# EAGLE schematic V3.6 - placa embutida (EAGLE 9.6.2)
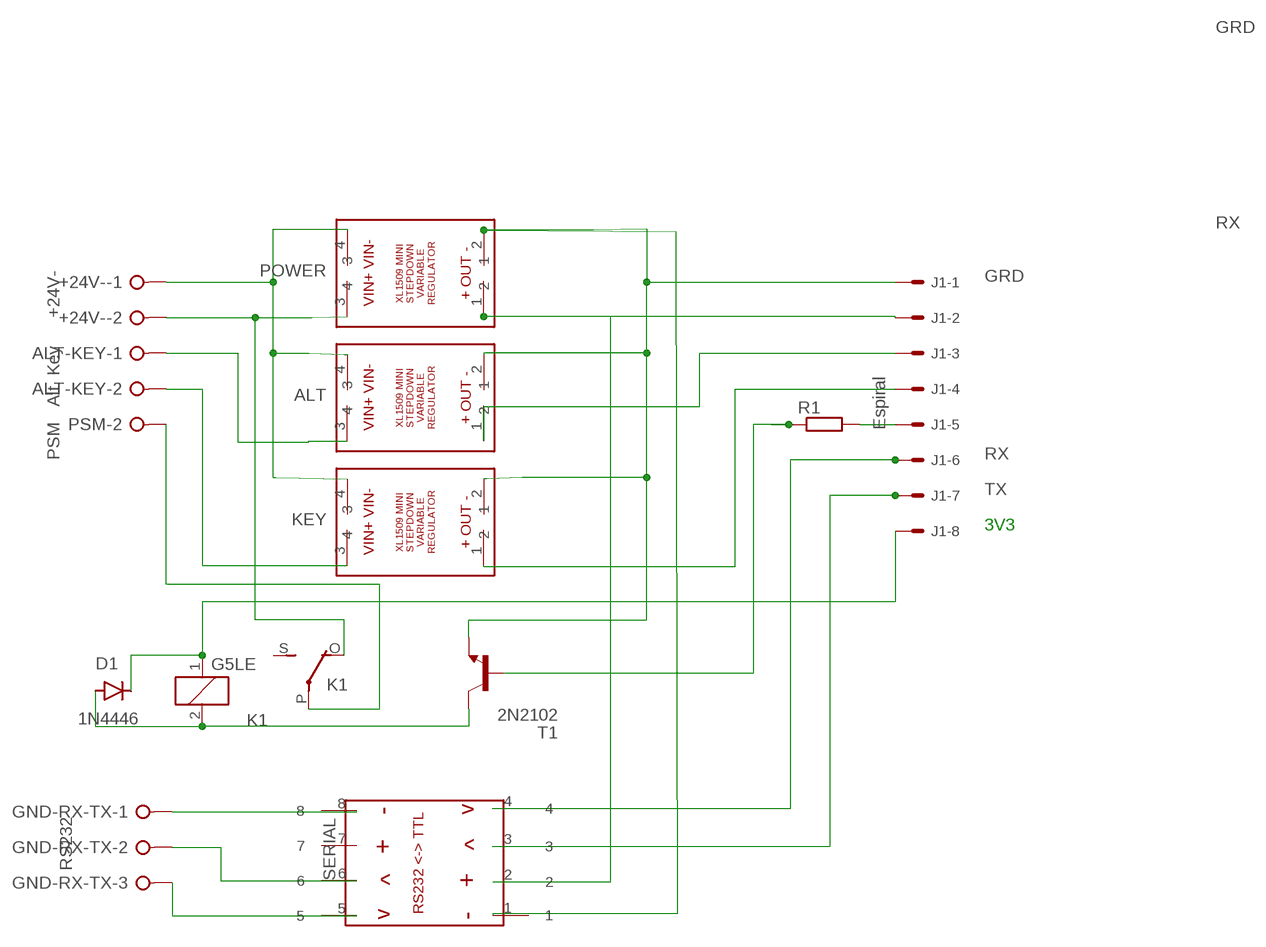
[diagram p0: schematic, sheet 1]

## Parts
+24V-  +24V-  W237-02P  [W237-132]
ALT  XL1509WITH_SMDPADS&THROUGHHOLES  [XL1509]
ALT-KEY  Alt Key  W237-02P  [W237-132]
D1  1N4446  [DO35-10]
GND-RX-TX  RS232  W237-03P  [W237-133]
J1  Espiral  22-05-7088-08  [7395-08]
K1  G5LE  [G5LE]
KEY  XL1509WITH_SMDPADS&THROUGHHOLES  [XL1509]
POWER  XL1509WITH_SMDPADS&THROUGHHOLES  [XL1509]
PSM  PSM  W237-02P  [W237-132]
R1  R-EU_0207/10  [0207/10]
SERIAL  MAX3232WITH_SMDPADS&THROUGHHOLES  [MAX3232]
T1  2N2102  [TO5]

## Nets
CHAVE: ALT.1 J1.3
GRD [New Class]: ALT.2 J1.1 KEY.2 POWER.2 SERIAL.1 T1.1(E)
N$1: +24V-.1 ALT.4 KEY.4 POWER.4
N$2: +24V-.2 K1.O(2:O) POWER.3
N$3: D1.C J1.8 K1.1
N$4: GND-RX-TX.1 SERIAL.8
N$5: ALT-KEY.1 ALT.3
N$6: ALT-KEY.2 KEY.3
N$7: GND-RX-TX.2 SERIAL.6
N$8: GND-RX-TX.3 SERIAL.5
N$9: J1.5 R1.2
N$10: R1.1 T1.2(B)
N$11: D1.A K1.2 T1.3(C)
N$12 [New Class]: J1.2 POWER.1 SERIAL.2
N$13: K1.P(2:P) PSM.2
N$20: J1.4 KEY.1
RX: J1.6 SERIAL.4
TX: J1.7 SERIAL.3
Unconnected: K1.S(2:S) PSM.1 SERIAL.7

## Notes on the sheet
- 3V3

## Library data of the parts
+24V- ALT-KEY PSM = con-wago-508:W237-02P: WAGO SREW CLAMP; OC_FARNELL: unknown; OC_NEWARK: unknown
ALT KEY POWER = XL1509 MINI STEPDOWN BUCK MODULE:XL1509: XL1509 Mini Stepdown Buck Module
D1 = diode:1N4446: DIODE high speed (Philips)
GND-RX-TX = con-wago-508:W237-03P: WAGO SREW CLAMP; OC_FARNELL: unknown; OC_NEWARK: unknown
J1 = con-molex:22-?-08: CONNECTOR wire to board 2.54 mm (.1 inch) pitch header; MF: MOLEX; OC_FARNELL: unknown; OC_NEWARK: unknown
K1 = relay:G5LE: RELAY 1 x switch, 10 A/120 V AC, 8 A/30 V DC, Omron; OC_FARNELL: unknown; OC_NEWARK: unknown
R1 = rcl:R-EU_: RESISTOR, European symbol; SPICEPREFIX: R
SERIAL = MINI RS232 TLP MAX3232:MAX3232: Mini RS232 to TTL Converter
T1 = transistor:2N2102: NPN TRANSISTOR

## Module LDR
Ports: 

### Library data of the parts

## Net classes
1 New Class: width 0.5 mm, drill 1 mm